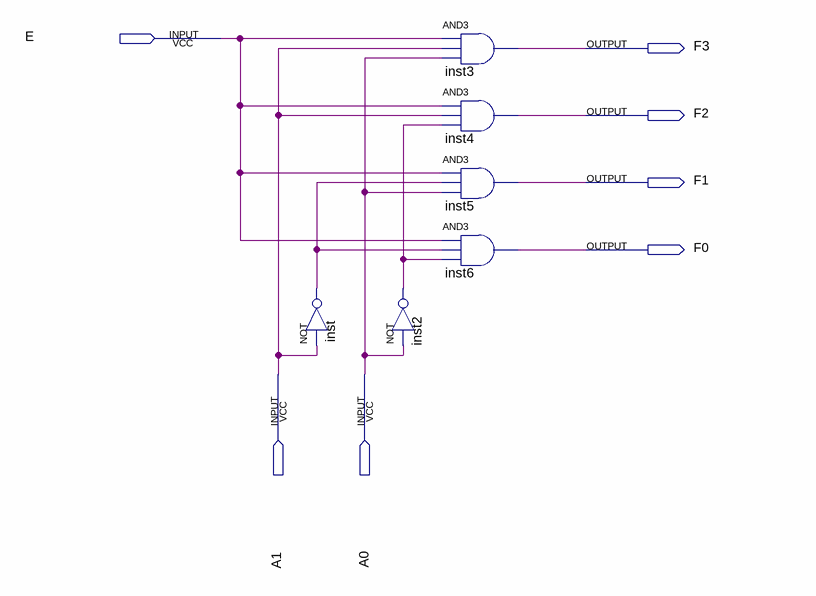
[diagram p0: schematic sheet]
// Quartus schematic decoder_2x4.bdf as structural Verilog: 6 symbols, 7 pins
module decoder_2x4 (
  input  E,
  input  A1,
  input  A0,
  output F3,
  output F2,
  output F1,
  output F0
);

  wire inst2_out, inst_out;

  not inst (inst_out, A1);
  and inst3 (F3, E, A1, A0);
  and inst4 (F2, E, A1, inst2_out);
  and inst5 (F1, E, inst_out, A0);
  and inst6 (F0, E, inst_out, inst2_out);
  not inst2 (inst2_out, A0);
endmodule
